# EAGLE design tiny_robot_renew (EAGLE 6.1)
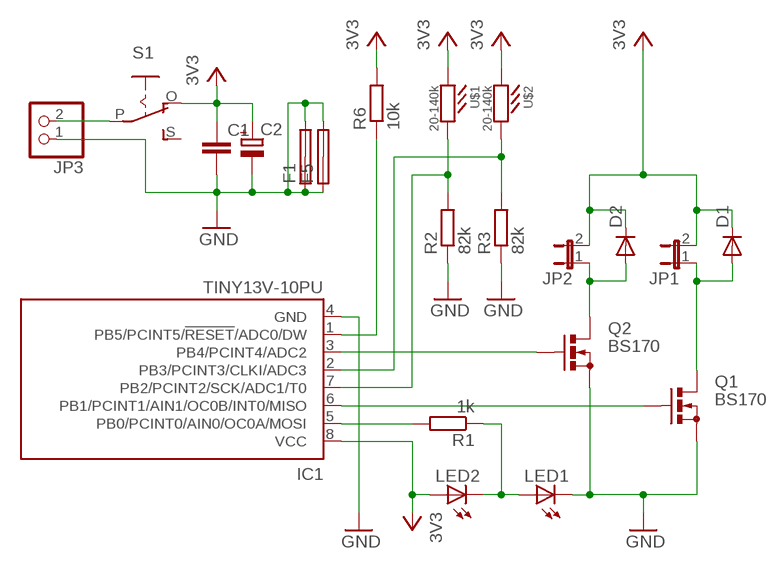
[diagram p0: schematic, sheet 1]

## Parts
C1  C-EU025-025X050  [C025-025X050]
C2  CPOL-EUE2,5-6E  [E2,5-6E]
D1  DIODE-D-2.5  [D-2.5]
D2  DIODE-D-2.5  [D-2.5]
F1  SHK20L  [SHK20L]
F5  SHK20Q  [SHK20Q]
IC1  TINY13V-10PU  [DIL08]
JP1  JP1E  [JP1]
JP2  JP1E  [JP1]
JP3  PINHD-1X2  [1X02]
LED1  LED3MM  [LED3MM]
LED2  LED3MM  [LED3MM]
Q1  BS170  [SOT54E]
Q2  BS170  [SOT54E]
R1  1k  R-EU_0204/7  [0204/7]
R2  82k  R-EU_0207/2V  [0207/2V]
R3  82k  R-EU_0207/2V  [0207/2V]
R6  10k  R-EU_0204/7  [0204/7]
S1  EG1218S  [EG1218]
U$1  20-140k  LDR-906014  [LDR-906014]
U$2  20-140k  LDR-906014  [LDR-906014]

## Nets
GND: C1.2 C2.- F1.1A F1.2A F5.1A F5.2A IC1.4(GND) JP3.1 LED1.K(C) Q1.S Q2.S R2.1 R3.1
N$1: IC1.3(PB4/PCINT4/ADC2) Q2.G
N$2: IC1.5(PB0/PCINT0/AIN0/OC0A/MOSI) R1.2
N$3: IC1.6(PB1/PCINT1/AIN1/OC0B/INT0/MISO) Q1.G
N$4: LED1.A LED2.K(C) R1.1
N$5: JP3.2 S1.P
N$11: D2.A JP2.1 Q2.D
N$12: D1.A JP1.1 Q1.D
N$13: IC1.2(PB3/PCINT3/CLKI/ADC3) R3.2 U$2.P$2
N$15: IC1.7(PB2/PCINT2/SCK/ADC1/T0) R2.2 U$1.P$2
RST: IC1.1(PB5/PCINT5/!RESET!/ADC0/DW) R6.1
VCC: C1.1 C2.+ D1.C D2.C IC1.8(VCC) JP1.2 JP2.2 LED2.A R6.2 S1.O U$1.P$1 U$2.P$1 ; supply symbol labelled 3V3
Unconnected: F1.1B F1.2B F5.1B F5.2B S1.S

## Library data of the parts
C1 = rcl:C-EU: CAPACITOR, European symbol
C2 = rcl:CPOL-EU: POLARIZED CAPACITOR, European symbol
D1 D2 = diode:DIODE-: DIODE
F1 = fuse:SHK20L: FUSE HOLDER 5 x 20 mm, SH contact, SHH1 Schukat, E1073 Buerklin; OC_FARNELL: unknown; OC_NEWARK: unknown
F5 = fuse:SHK20Q: FUSE HOLDER 5 x 20 mm, SH contact, E1207 Buerklin 64G6061; OC_FARNELL: unknown; OC_NEWARK: unknown
IC1 = atmel:TINY13: 8-bit AVR Microcontroller with 1K Bytes In-System Programmable Flash Source: http://www.atmel.com/dyn/resources/prod_documents/2535S.pdf; MPN: ATTINY13V-10PU; OC_FARNELL: 9171576; OC_NEWARK: 96K6523
JP1 JP2 = jumper:JP1E: JUMPER
JP3 = pinhead:PINHD-1X2: PIN HEADER
LED1 LED2 = led:LED: LED OSRAM: - CHIPLED LG R971, LG N971, LY N971, LG Q971, LY Q971, LO R971, LY R971 LH N974, LH R974 LS Q976, LO Q976, LY Q976 LO Q996 - Hyper CHIPLED LW Q18S LB Q993, LB Q99A, LB R99A - SideLED LS A670, LO A670, LY A670, LG A670, LP A670 LB A673, LV A673, LT A673, LW A673 LH A674 LY A675 LS A676, LA A676, LO A676, LY A676, LW A676 LS A679, LY A679, LG A679 - Hyper Micro SIDELED® LS Y876, LA Y876, LO Y876, LY Y876 LT Y87S - SmartLED LW L88C, LW L88S LB L89C, LB L89S, LG L890 LS L89K, LO L89K, LY L89K LS L896, LA L896, LO L896, LY L896 - TOPLED LS T670, LO T670, LY T670, LG T670, LP T670 LSG T670, LSP T670, LSY T670, LOP T670, LYG T670 LG T671, LOG T671, LSG T671 LB T673, LV T673, LT T673, LW T673 LH T674 LS T676, LA T676, LO T676, LY T676, LB T676, LH T676, LSB T676, LW T676 LB T67C, LV T67C, LT T67C, LS T67K, LO T67K, LY T67K, LW E67C LS E67B, LA E67B, LO E67B, LY E67B, LB E67C, LV E67C, LT E67C LW T67C LS T679, LY T679, LG T679 LS T770, LO T770, LY T770, LG T770, LP T770 LB T773, LV T773, LT T773, LW T773 LH T774 LS E675, LA E675, LY E675, LS T675 LS T776, LA T776, LO T776, LY T776, LB T776 LHGB T686 LT T68C, LB T68C - Hyper Mini TOPLED® LB M676 - Mini TOPLED Santana® LG M470 LS M47K, LO M47K, LY M47K Source: http://www.osram.convergy.de LUXEON: - LUMILED® LXK2-PW12-R00, LXK2-PW12-S00, LXK2-PW14-U00, LXK2-PW14-V00 LXK2-PM12-R00, LXK2-PM12-S00, LXK2-PM14-U00 LXK2-PE12-Q00, LXK2-PE12-R00, LXK2-PE12-S00, LXK2-PE14-T00, LXK2-PE14-U00 LXK2-PB12-K00, LXK2-PB12-L00, LXK2-PB12-M00, LXK2-PB14-N00, LXK2-PB14-P00, LXK2-PB14-Q00 LXK2-PR12-L00, LXK2-PR12-M00, LXK2-PR14-Q00, LXK2-PR14-R00 LXK2-PD12-Q00, LXK2-PD12-R00, LXK2-PD12-S00 LXK2-PH12-R00, LXK2-PH12-S00 LXK2-PL12-P00, LXK2-PL12-Q00, LXK2-PL12-R00 Source: www.luxeon.com KINGBRIGHT: KA-3528ASYC Source: www.kingbright.com
Q1 Q2 = transistor-small-signal:BS170: N-CHANNEL MOS FET
R1-R3 R6 = rcl:R-EU_: RESISTOR, European symbol
S1 = _MY_OWN_LIB:EG1218: SLIDING SWITCH 0.1" spacing through hole, vertical SPDT slide switch http://www.ladyada.net/library/pcb/eaglelibrary.html
U$1 U$2 = alex:LDR-906014

## Board
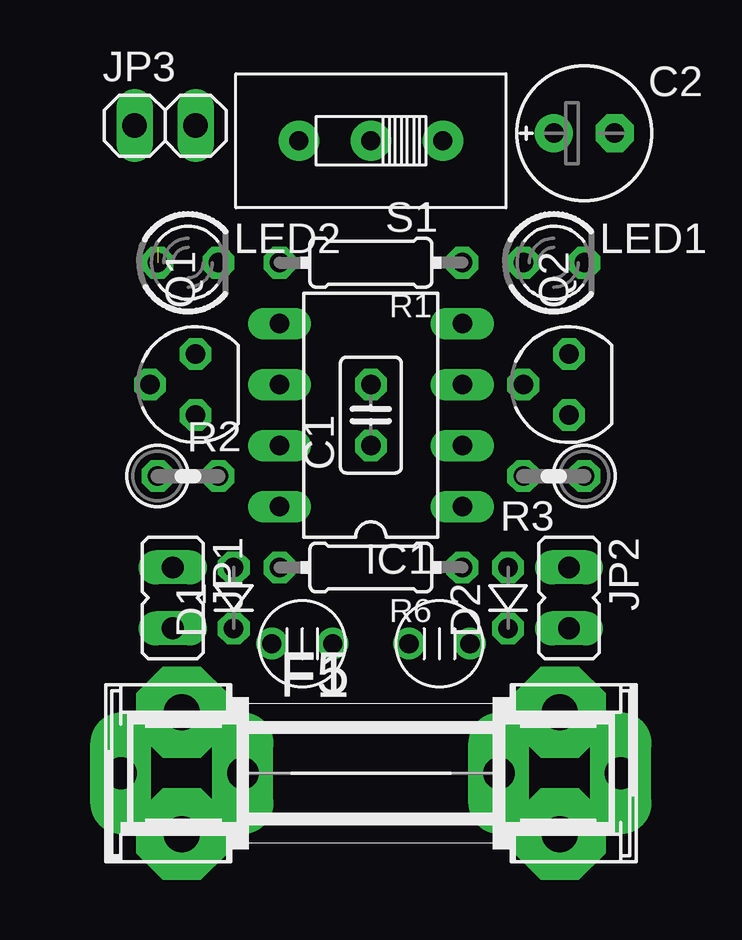
[diagram p1: board, top side]
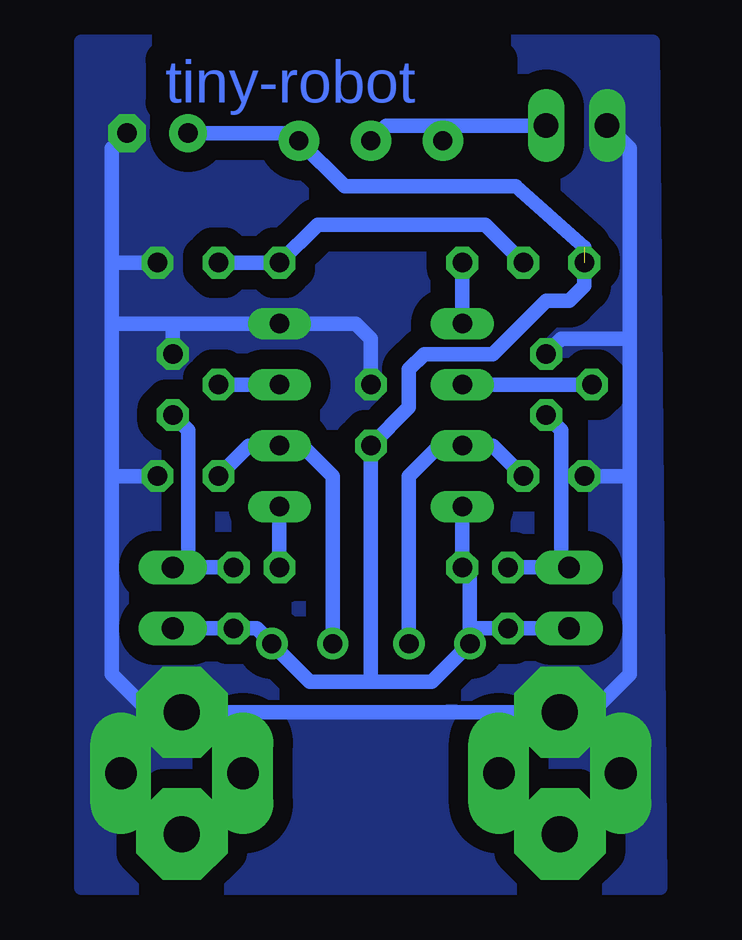
[diagram p2: board, bottom side, seen from below]

No outline drawn. Coordinates in mm, seen from the top.
Copper layers (1*16): Top 0.035mm / dielectric 1.5mm / Bottom 0.035mm
Design rules: minimum track width 10mil, minimum drill 24mil, track to track 8mil, track to pad 8mil, pad to pad 8mil, via to via 8mil, smd to smd 8mil, copper to edge 40mil, drill to drill 8mil, minimum pad ring 10mil, minimum via ring 8mil, stop-mask expansion 4mil, vias tented up to drill 0mil, thermal gap 10mil

### Footprints (pad centres in the part's own frame; a part is rotated, then mirrored left to right if it is on the bottom)
C025-025X050 = drill 0.813 octagon: 1 -1.27,0; 2 1.27,0
E2,5-6E = drill 0.813 pad 1.575: + -1.27,0 | drill 0.813 pad 1.575 octagon: - 1.27,0
D-2.5 = drill 0.813 octagon: A 1.27,0; C -1.27,0
SHK20L = drill 1.321 pad 2.54 long: 1A -10.414,0; 1B -5.334,0; 2A 10.414,0; 2B 5.334,0
SHK20Q = drill 1.5 pad 3.81 octagon: 1A -7.874,2.54; 1B -7.874,-2.54; 2A 7.874,2.54; 2B 7.874,-2.54
DIL08 = drill 0.813 long: 1 -3.81,-3.81; 2 -1.27,-3.81; 3 1.27,-3.81; 4 3.81,-3.81; 5 3.81,3.81; 6 1.27,3.81; 7 -1.27,3.81; 8 -3.81,3.81
JP1 = drill 0.914 long: 1 0,-1.27; 2 0,1.27
1X02 = drill 1.016 long: 1 -1.27,0; 2 1.27,0
LED3MM = drill 0.813 octagon: A -1.27,0; K 1.27,0
SOT54E = drill 0.813 octagon: D -1.27,0; G 0,1.905; S 1.27,0
0204/7 = drill 0.813 octagon: 1 -3.81,0; 2 3.81,0
0207/2V = drill 0.813 octagon: 1 -1.27,0; 2 1.27,0
EG1218 = drill 0.8 pad 1.676: O -3,0; P 0,0; S 3,0
LDR-906014 = drill 0.8 pad 1.27: P$1 0,1.27; P$2 0,-1.27

### Placement (x,y rotation side)
C1  12.06,19.68 90 top
C2  20.95,31.43 0 top
D1  6.35,12.06 90 top
D2  17.78,12.06 90 top
F1  12.06,4.76 0 top
F5  12.06,4.76 0 top
IC1  12.06,19.68 90 top
JP1  3.81,12.06 180 top
JP2  20.32,12.06 180 top
JP3  3.49,31.75 0 top
LED1  19.68,26.04 0 top
LED2  4.45,26.04 0 top
Q1  4.76,20.95 90 top
Q2  20.32,20.95 90 top
R1  12.06,26.04 180 top
R2  4.45,17.14 0 top
R3  19.68,17.14 180 top
R6  12.06,13.34 180 top
S1  12.06,31.11 180 top
U$1  9.21,10.16 90 top
U$2  14.92,10.16 270 top

### Tracks (layer width: path | path; a pad name or v marks a point on that pad's centre or on a via)
GND
  Bottom 0.61: Q1.S 4.13,22.86 1.27,22.86 | 1.27,17.14 1.27,8.89 2.86,7.3 21.27,7.3 22.86,8.89 22.86,17.14 | R2.1 1.27,17.14 | 22.86,17.14 22.86,23.5 | 20.32,23.5 IC1.4 12.7,23.5 12.06,22.86 C1.2 | 20.32,23.5 22.86,23.5 | Q2.S 20.32,23.5 | R3.1 22.86,17.14 | 1.27,17.14 1.27,22.86 | 1.27,22.86 1.27,30.8 JP3.1 | C2.- 22.86,30.8 22.86,26.04 | 22.86,26.04 22.86,23.5 | LED1.K 22.86,26.04
  pour Bottom (isolate 0.813, no thermals): 0,0 24.13,0 24.13,35.24 0.32,35.24
N$1
  Bottom 0.61: IC1.3 Q2.G
N$2
  Bottom 0.61: IC1.5 R1.2
N$3
  Bottom 0.61: Q1.G IC1.6
N$4
  Bottom 0.61: LED1.A R1.1 14.29,27.62 7.3,27.62 LED2.K
N$5
  Bottom 0.61: JP3.2 11.43,31.75 S1.P
N$11
  Bottom 0.61: D2.A JP2.1 19.68,13.65 19.68,19.05 Q2.D
N$12
  Bottom 0.61: D1.A JP1.1 4.13,13.34 4.13,19.05 Q1.D
N$13
  Bottom 0.61: R3.2 17.14,18.41 IC1.2 14.92,18.41 13.65,17.14 U$2.P$2
N$15
  Bottom 0.61: R2.2 6.99,18.41 IC1.7 9.21,18.41 10.48,17.14 U$1.P$2
RST
  Bottom 0.61: R6.1 IC1.1
VCC  (1 unrouted)
  Bottom 0.61: D1.C JP1.2 7.94,10.79 | D2.C JP2.2 16.83,10.79 U$2.P$1 14.61,8.57 12.06,8.57 | 12.06,8.57 9.53,8.57 U$1.P$1 7.94,10.79 | IC1.8 R6.2 7.94,13.02 7.94,10.79 | 12.06,8.57 C1.1 10.48,20 10.48,21.59 9.84,22.23 6.99,22.23 4.76,24.45 3.81,24.45 3.17,25.08 3.17,26.67 6.03,29.21 13.16,29.21 S1.O 15.38,31.43 C2.+

### Text on the board
Bottom: tiny-robot